# Altium schematic sheet v1.0.SchDoc
size 63 x 50 mm
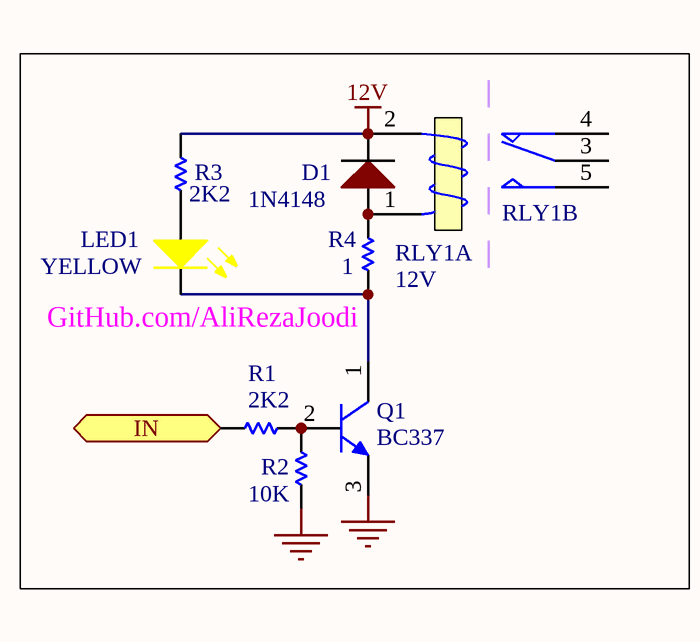
[diagram p0: v1.0.SchDoc]

## Parts
D1  1N4148  [D_THD_AXIAL0.3_DO-35]
LED1  YELLOW  [LED_THD_3MM_YELLOW_R]
Q1  BC337  [TO92C]
R1  2K2  [R_THD_AXIAL0.4(1/4W)]
R2  10K  [R_THD_AXIAL0.4(1/4W)]
R3  2K2  [R_THD_AXIAL0.4(1/4W)]
R4  1  [R_THD_AXIAL0.4(1/4W)]
RLY1  12V  [RELAY_SPDT_5PIN_2216]  (parts A,B of 2)

## Ports
IN (in)

## Nets
12V: D1.2(K) R3.2 RLY1.2(T1)
GND: Q1.3(E) R2.1
IN: R1.2 ; port IN
NetD1_1: D1.1(A) R4.2 RLY1.1(T2)
NetLED1_1: LED1.1(A) R3.1
NetLED1_2: LED1.2(K) Q1.1(C) R4.1
NetQ1_2: Q1.2(B) R1.1 R2.2

Not connected (* = marked no-connect by the designer): RLY1 3(COM) 4(NC) 5(NO)

## Notes on the sheet
- GitHub.com/AliRezaJoodi

## Library data of the parts
D1 = Diode_2Form: Diode,; Revision: July-2002: Re-released for DXP Platform.
LED1 = LED_YELLOW: LED, Yellow; Manufacturer: Generic Components; Class I: Optoelectronic; Published: 8-Jun-2000; Revision: July-2002: Re-released for DXP Platform.; Publisher: Altium Limited; Class II: LED
Q1 = NPN: NPN Bipolar Transistor; Manufacturer: Generic Components; Class I: Discrete; Class II: BJT - Low Power; Published: 8-Jun-2000; Revision: July-2002: Re-released for DXP Platform.; Publisher: Altium Limited
R1-R4 = Resistor: Revision: July-2002: Re-released for DXP Platform.
RLY1 = Relay_SPDT_2Form: SPDT Relay